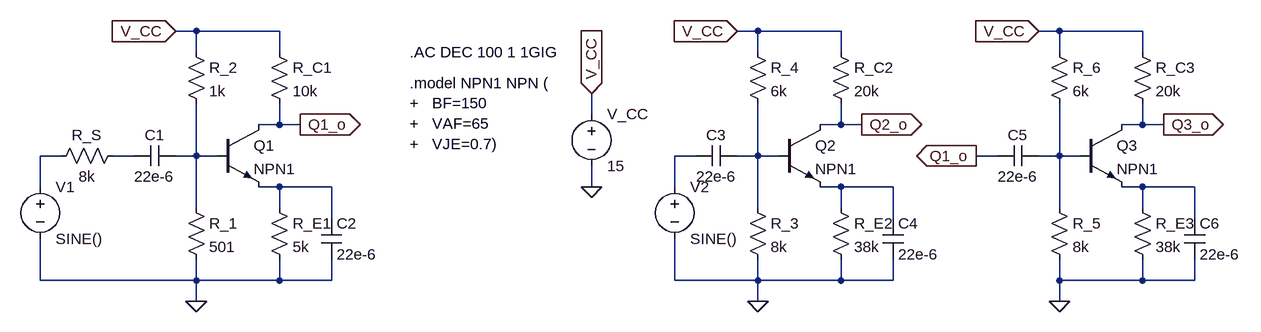
[diagram p0: schematic Test BJT Amplifier.asc]
Test BJT Amplifier.asc, the LTspice schematic file:
Version 4
SHEET 1 1804 884
WIRE 192 -64 160 -64
WIRE 320 -64 192 -64
WIRE 1056 -64 1024 -64
WIRE 1184 -64 1056 -64
WIRE 1520 -64 1488 -64
WIRE 1648 -64 1520 -64
WIRE 192 -32 192 -64
WIRE 320 -32 320 -64
WIRE 1056 -32 1056 -64
WIRE 1184 -32 1184 -64
WIRE 1520 -32 1520 -64
WIRE 1648 -32 1648 -64
WIRE 800 64 800 32
WIRE 320 80 320 48
WIRE 320 80 288 80
WIRE 352 80 320 80
WIRE 1184 80 1184 48
WIRE 1184 80 1152 80
WIRE 1216 80 1184 80
WIRE 1648 80 1648 48
WIRE 1648 80 1616 80
WIRE 1680 80 1648 80
WIRE -16 128 -48 128
WIRE 96 128 64 128
WIRE 192 128 192 48
WIRE 192 128 160 128
WIRE 224 128 192 128
WIRE 960 128 928 128
WIRE 1056 128 1056 48
WIRE 1056 128 1024 128
WIRE 1088 128 1056 128
WIRE 1424 128 1392 128
WIRE 1520 128 1520 48
WIRE 1520 128 1488 128
WIRE 1552 128 1520 128
WIRE -48 176 -48 128
WIRE 320 176 288 176
WIRE 400 176 320 176
WIRE 800 176 800 144
WIRE 928 176 928 128
WIRE 1184 176 1152 176
WIRE 1264 176 1184 176
WIRE 1648 176 1616 176
WIRE 1728 176 1648 176
WIRE 192 208 192 128
WIRE 320 208 320 176
WIRE 1056 208 1056 128
WIRE 1184 208 1184 176
WIRE 1520 208 1520 128
WIRE 1648 208 1648 176
WIRE 400 224 400 176
WIRE 1264 224 1264 176
WIRE 1728 224 1728 176
WIRE -48 320 -48 256
WIRE 192 320 192 288
WIRE 192 320 -48 320
WIRE 320 320 320 288
WIRE 320 320 192 320
WIRE 400 320 400 288
WIRE 400 320 320 320
WIRE 928 320 928 256
WIRE 1056 320 1056 288
WIRE 1056 320 928 320
WIRE 1184 320 1184 288
WIRE 1184 320 1056 320
WIRE 1264 320 1264 288
WIRE 1264 320 1184 320
WIRE 1520 320 1520 288
WIRE 1648 320 1648 288
WIRE 1648 320 1520 320
WIRE 1728 320 1728 288
WIRE 1728 320 1648 320
WIRE 192 352 192 320
WIRE 1056 352 1056 320
WIRE 1520 352 1520 320
FLAG 192 352 0
FLAG 352 80 Q1_o
IOPIN 352 80 Out
FLAG 160 -64 V_CC
IOPIN 160 -64 In
FLAG 800 32 V_CC
IOPIN 800 32 In
FLAG 800 176 0
FLAG 1056 352 0
FLAG 1216 80 Q2_o
IOPIN 1216 80 Out
FLAG 1024 -64 V_CC
IOPIN 1024 -64 In
FLAG 1520 352 0
FLAG 1680 80 Q3_o
IOPIN 1680 80 Out
FLAG 1488 -64 V_CC
IOPIN 1488 -64 In
FLAG 1392 128 Q1_o
IOPIN 1392 128 Out
SYMBOL npn 224 80 R0
SYMATTR InstName Q1
SYMATTR Value NPN1
SYMBOL Res 304 192 R0
SYMATTR InstName R_E1
SYMATTR Value 5k
SYMBOL Res 304 -48 R0
SYMATTR InstName R_C1
SYMATTR Value 10k
SYMBOL Res 176 192 R0
SYMATTR InstName R_1
SYMATTR Value 501
SYMBOL Cap 160 112 R90
WINDOW 0 0 32 VBottom 2
WINDOW 3 32 32 VTop 2
SYMATTR InstName C1
SYMATTR Value 22e-6
SYMBOL Res 176 -48 R0
SYMATTR InstName R_2
SYMATTR Value 1k
SYMBOL Cap 384 224 R0
SYMATTR InstName C2
SYMATTR Value 22e-6
SYMBOL Voltage 800 48 R0
SYMATTR InstName V_CC
SYMATTR Value 15
SYMBOL Voltage -48 160 R0
SYMATTR InstName V1
SYMATTR Value SINE()
SYMATTR Value2 AC 1
SYMBOL npn 1088 80 R0
SYMATTR InstName Q2
SYMATTR Value NPN1
SYMBOL Res 1168 192 R0
SYMATTR InstName R_E2
SYMATTR Value 38k
SYMBOL Res 1168 -48 R0
SYMATTR InstName R_C2
SYMATTR Value 20k
SYMBOL Res 1040 192 R0
SYMATTR InstName R_3
SYMATTR Value 8k
SYMBOL Cap 1024 112 R90
WINDOW 0 0 32 VBottom 2
WINDOW 3 32 32 VTop 2
SYMATTR InstName C3
SYMATTR Value 22e-6
SYMBOL Res 1040 -48 R0
SYMATTR InstName R_4
SYMATTR Value 6k
SYMBOL Cap 1248 224 R0
SYMATTR InstName C4
SYMATTR Value 22e-6
SYMBOL Voltage 928 160 R0
SYMATTR InstName V2
SYMATTR Value SINE()
SYMATTR Value2 AC 1
SYMBOL Res 80 112 R90
WINDOW 0 0 56 VBottom 2
WINDOW 3 32 56 VTop 2
SYMATTR InstName R_S
SYMATTR Value 8k
SYMBOL npn 1552 80 R0
SYMATTR InstName Q3
SYMATTR Value NPN1
SYMBOL Res 1632 192 R0
SYMATTR InstName R_E3
SYMATTR Value 38k
SYMBOL Res 1632 -48 R0
SYMATTR InstName R_C3
SYMATTR Value 20k
SYMBOL Res 1504 192 R0
SYMATTR InstName R_5
SYMATTR Value 8k
SYMBOL Cap 1488 112 R90
WINDOW 0 0 32 VBottom 2
WINDOW 3 32 32 VTop 2
SYMATTR InstName C5
SYMATTR Value 22e-6
SYMBOL Res 1504 -48 R0
SYMATTR InstName R_6
SYMATTR Value 6k
SYMBOL Cap 1712 224 R0
SYMATTR InstName C6
SYMATTR Value 22e-6
TEXT 520 -32 Left 2 !.AC DEC 100 1 1GIG
TEXT 520 16 Left 2 !.model NPN1 NPN (\n+   BF=150\n+   VAF=65\n+   VJE=0.7)

The netlist it stands for:
* Test BJT Amplifier.asc
Q1 Q1_o N003 N007 0 NPN1
R_E1 N007 0 5k
R_C1 V_CC Q1_o 10k
R_1 N003 0 501
C1 N003 N002 22e-6
R_2 V_CC N003 1k
C2 N007 0 22e-6
V_CC V_CC 0 15
V1 N001 0 SINE() AC 1
Q2 Q2_o N005 N008 0 NPN1
R_E2 N008 0 38k
R_C2 V_CC Q2_o 20k
R_3 N005 0 8k
C3 N005 N004 22e-6
R_4 V_CC N005 6k
C4 N008 0 22e-6
V2 N004 0 SINE() AC 1
R_S N002 N001 8k
Q3 Q3_o N006 N009 0 NPN1
R_E3 N009 0 38k
R_C3 V_CC Q3_o 20k
R_5 N006 0 8k
C5 N006 Q1_o 22e-6
R_6 V_CC N006 6k
C6 N009 0 22e-6
.model NPN NPN
.model PNP PNP
.lib standard.bjt
.AC DEC 100 1 1GIG
.model NPN1 NPN (
+   BF=150
+   VAF=65
+   VJE=0.7)
.backanno
.end